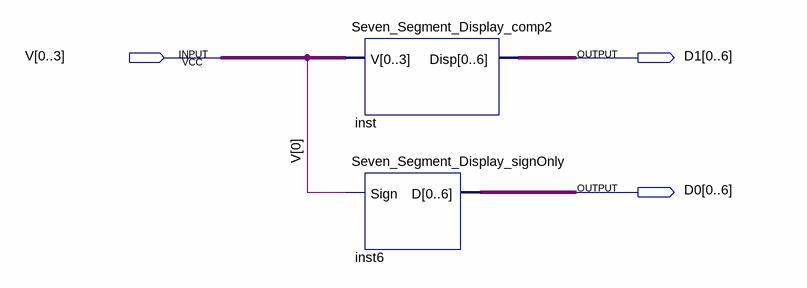
[diagram p0: schematic sheet]
// Quartus schematic Display.bdf as structural Verilog: 2 symbols, 3 pins
module Display (
  input  [0:3] V,
  output [0:6] D1,
  output [0:6] D0
);

  Seven_Segment_Display_comp2 inst (.V(V), .Disp(D1));
  Seven_Segment_Display_signOnly inst6 (.Sign(V[0]), .D(D0));
endmodule
